# EAGLE design ticc (EAGLE 7.7.0)
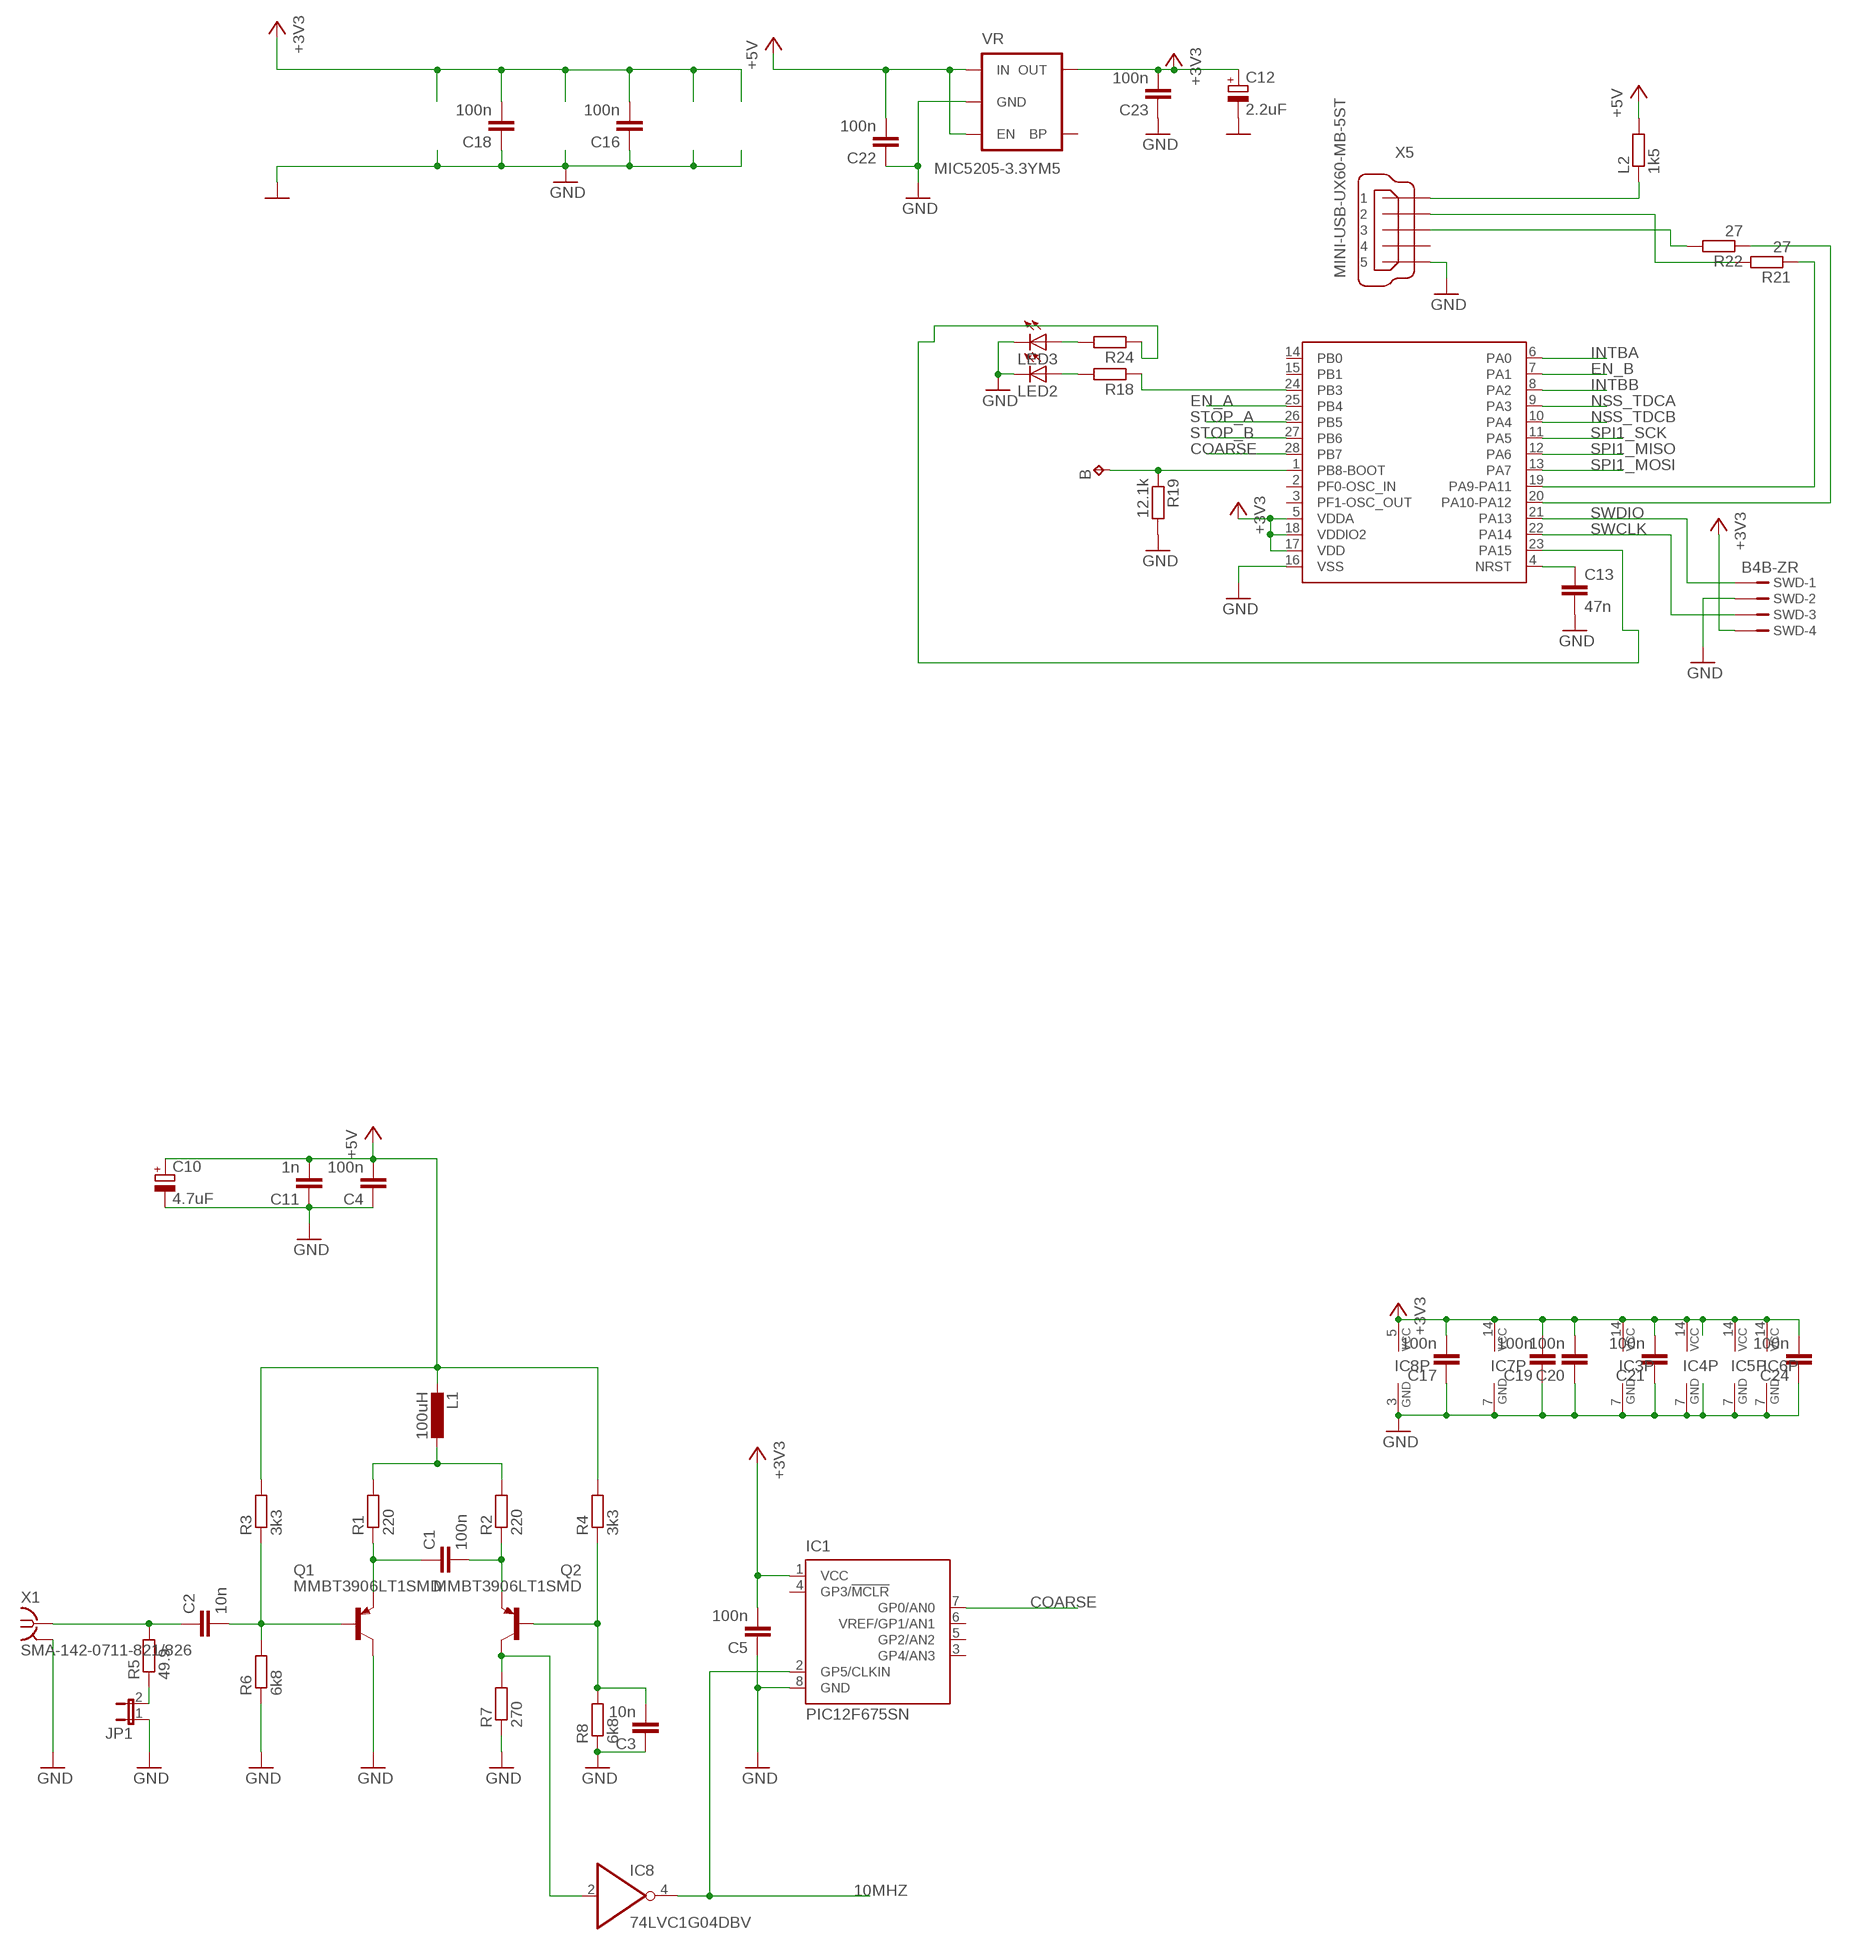
[diagram p0: schematic, sheet 1, part 1 of 2]
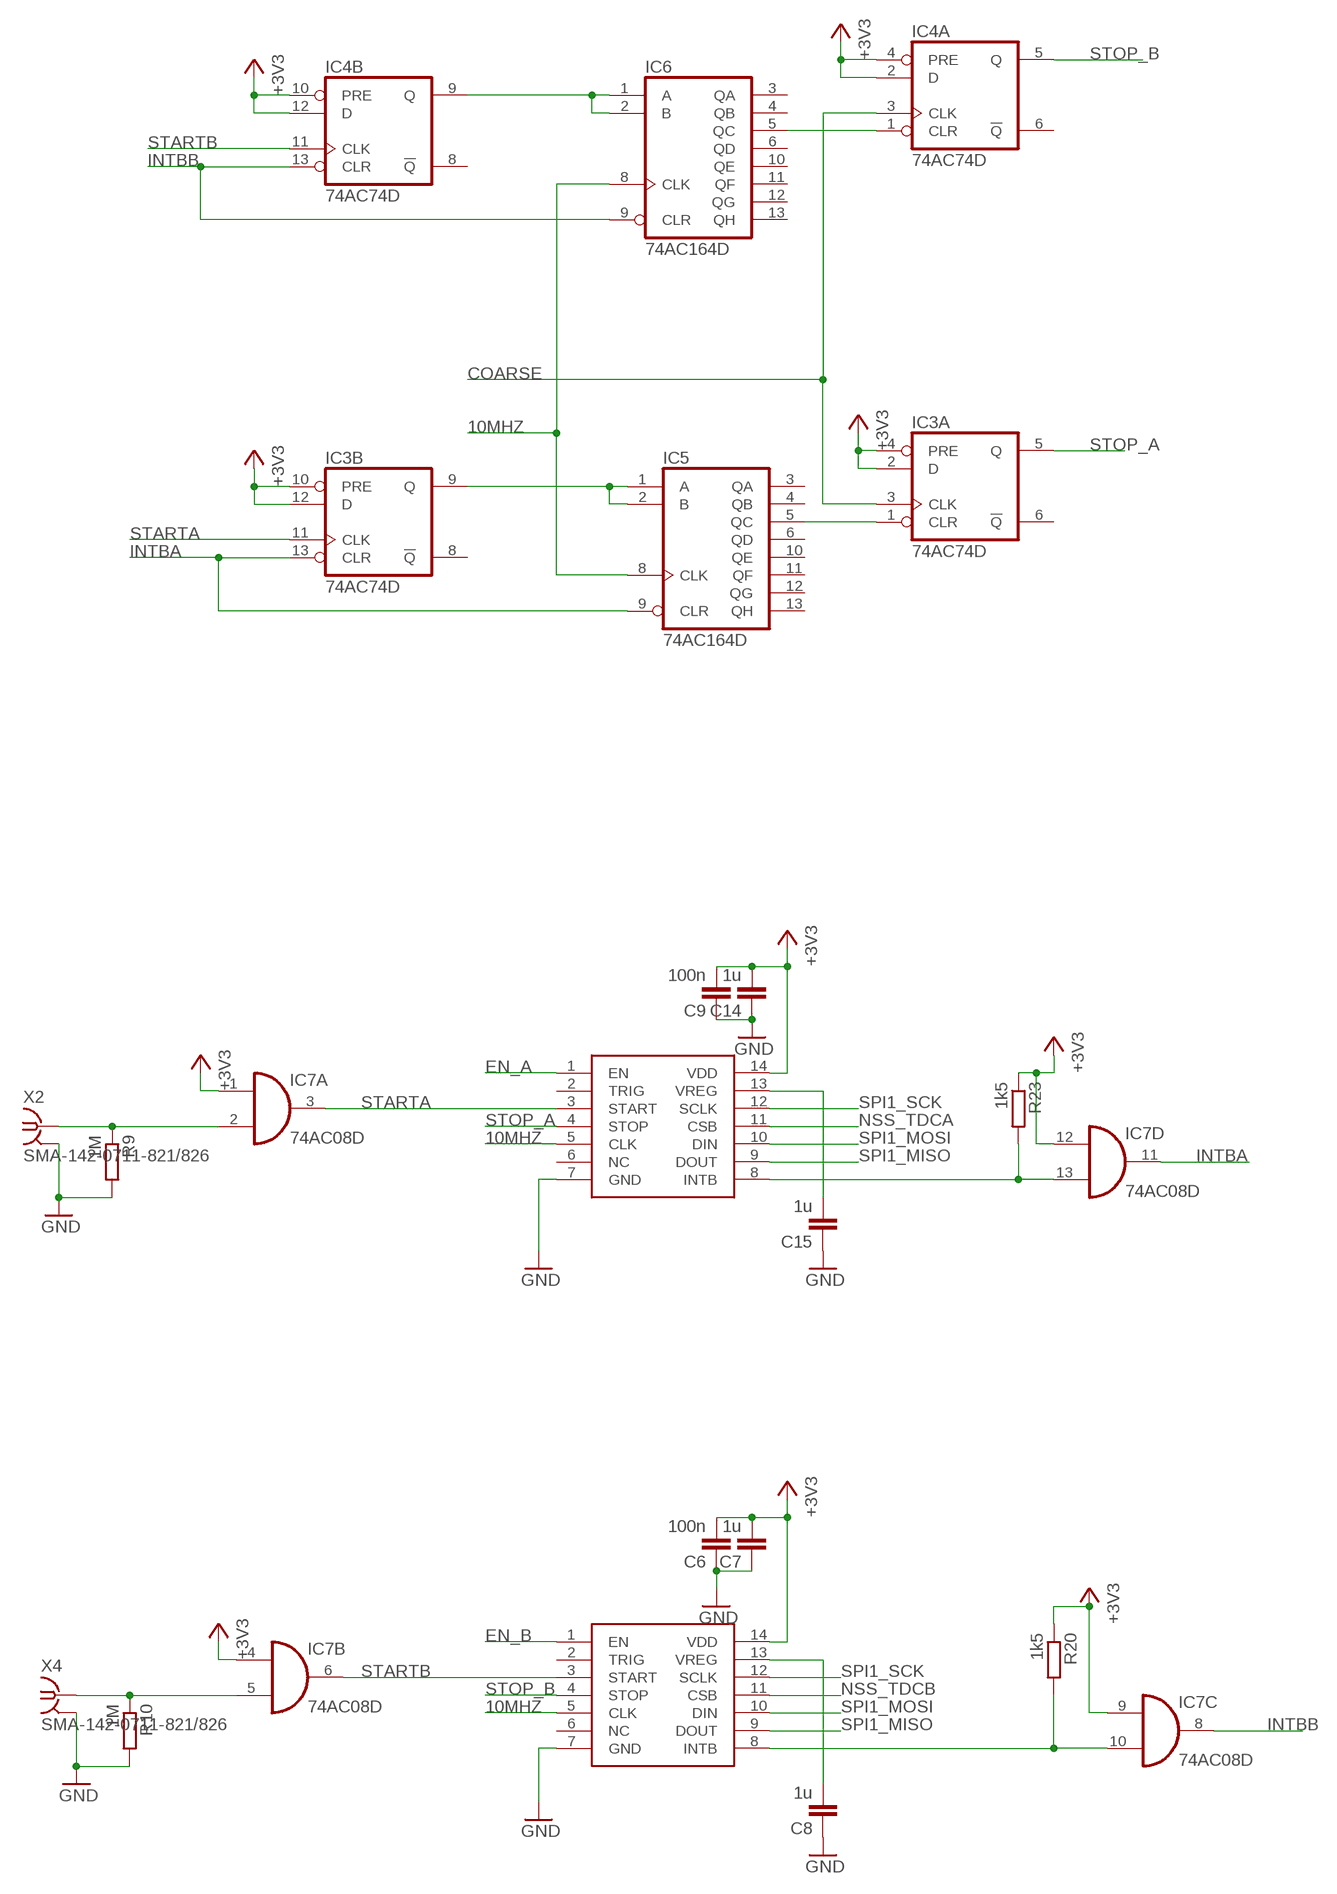
[diagram p1: schematic, sheet 1, part 2 of 2]

## Parts
B  TPB1,27  [B1,27]
C1  100n  C-EUC0603  [C0603]
C2  10n  C-EUC0603  [C0603]
C3  10n  C-EUC0603  [C0603]
C4  100n  C-EUC0603  [C0603]
C5  100n  C-EUC0603  [C0603]
C6  100n  C-EUC0603  [C0603]
C7  1u  C-EUC0603  [C0603]
C8  1u  C-EUC0603  [C0603]
C9  100n  C-EUC0603  [C0603]
C10  4.7uF  CPOL-EUSMCA  [SMC_A]
C11  1n  C-EUC0603  [C0603]
C12  2.2uF  CPOL-EUSMCA  [SMC_A]
C13  47n  C-EUC0603  [C0603]
C14  1u  C-EUC0603  [C0603]
C15  1u  C-EUC0603  [C0603]
C16  100n  C-EUC0603  [C0603]
C17  100n  C-EUC0603  [C0603]
C18  100n  C-EUC0603  [C0603]
C19  100n  C-EUC0603  [C0603]
C20  100n  C-EUC0603  [C0603]
C21  100n  C-EUC0603  [C0603]
C22  100n  C-EUC0805K  [C0805K]
C23  100n  C-EUC0805K  [C0805K]
C24  100n  C-EUC0603  [C0603]
IC1  PIC12F675SN  [SO-08]
IC3  74AC74D  [SO14]
IC4  74AC74D  [SO14]
IC5  74AC164D  [SO14]
IC6  74AC164D  [SO14]
IC7  74AC08D  [SO14]
IC8  74LVC1G04DBV  [SOT23-5]
JP1  JUMPER-2PTH  [1X02]
L1  100uH  L-EUL2012C  [L2012C]
L2  1k5  R-EU_R0805  [R0805]
LED2  LEDCHIP-LED0805  [CHIP-LED0805]
LED3  LEDCHIP-LED0805  [CHIP-LED0805]
Q1  MMBT3906LT1SMD  [SOT23-BEC]
Q2  MMBT3906LT1SMD  [SOT23-BEC]
R1  220  R-EU_R0603  [R0603]
R2  220  R-EU_R0603  [R0603]
R3  3k3  R-EU_R0603  [R0603]
R4  3k3  R-EU_R0603  [R0603]
R5  49.9  R-EU_R0603  [R0603]
R6  6k8  R-EU_R0603  [R0603]
R7  270  R-EU_R0603  [R0603]
R8  6k8  R-EU_R0603  [R0603]
R9  1M  R-EU_R0603  [R0603]
R10  1M  R-EU_R0603  [R0603]
R18  R-EU_R0603  [R0603]
R19  12.1k  R-EU_R0603  [R0603]
R20  1k5  R-EU_R0603  [R0603]
R21  27  R-EU_R0603  [R0603]
R22  27  R-EU_R0603  [R0603]
R23  1k5  R-EU_R0603  [R0603]
R24  R-EU_R0603  [R0603]
SWD  B4B-ZR  [B4B-ZR]
U$1  STM32F042G  [QFN28]
U$2  TDC7200  [TSSOP14]
U$3  TDC7200  [TSSOP14]
VR  MIC5205-3.3YM5  V_REG_LDOSMD  [SOT23-5]
X1  SMA-142-0711-821/826  [J502-ND-142-0711-821/826]
X2  SMA-142-0711-821/826  [J502-ND-142-0711-821/826]
X4  SMA-142-0711-821/826  [J502-ND-142-0711-821/826]
X5  MINI-USB-UX60-MB-5ST  [UX60-MB-5ST]

## Nets
10MHZ: IC1.2(GP5/CLKIN) IC5.8(CLK) IC6.8(CLK) IC8.4(O) U$2.5(CLK) U$3.5(CLK)
+3V3: C5.2 C6.2 C7.2 C9.2 C12.+ C14.2 C16.2 C17.2 C18.2 C19.2 C20.2 C21.2 C23.2 C24.2 IC1.1(VCC) IC3.2(A:D) IC3.4(A:PRE) IC3.10(B:PRE) IC3.12(B:D) IC3.14(P:VCC) IC4.2(A:D) IC4.4(A:PRE) IC4.10(B:PRE) IC4.12(B:D) IC4.14(P:VCC) IC5.14(VCC) IC6.14(VCC) IC7.1(A:I0) IC7.4(B:I0) IC7.9(C:I0) IC7.12(D:I0) IC7.14(P:VCC) IC8.5(VCC) R20.1 R23.1 SWD.4 U$1.5(VDDA) U$1.17(VDD) U$1.18(VDDIO2) U$2.14(VDD) U$3.14(VDD) VR.5(OUT)
+5V: C4.2 C10.+ C11.2 C22.2 L1.2 L2.2 R3.2 R4.2 VR.1(IN) VR.3(EN)
COARSE: IC1.7(GP0/AN0) IC3.3(A:CLK) IC4.3(A:CLK) U$1.28(PB7)
EN_A: U$1.25(PB4) U$2.1(EN)
EN_B: U$1.7(PA1) U$3.1(EN)
GND: C3.1 C4.1 C5.1 C6.1 C7.1 C8.1 C9.1 C10.- C11.1 C12.- C13.2 C14.1 C15.1 C16.1 C17.1 C18.1 C19.1 C20.1 C21.1 C22.1 C23.1 C24.1 IC1.8(GND) IC3.7(P:GND) IC4.7(P:GND) IC5.7(GND) IC6.7(GND) IC7.7(P:GND) IC8.3(GND) JP1.1 LED2.C LED3.C Q1.C R6.1 R7.1 R8.1 R9.2 R10.2 R19.2 SWD.2 U$1.16(VSS) U$2.7(GND) U$3.7(GND) VR.2(GND) X1.G@1(GND) X2.G@1(GND) X4.G@1(GND) X5.5
INTBA: IC3.13(B:CLR) IC5.9(CLR) IC7.11(D:O) U$1.6(PA0)
INTBB: IC4.13(B:CLR) IC6.9(CLR) IC7.8(C:O) U$1.8(PA2)
N$1: C3.2 Q2.B R4.1 R8.2
N$2: JP1.2 R5.1
N$3: C2.1 R5.2 X1.1
N$4: C2.2 Q1.B R3.1 R6.2
N$5: L1.1 R1.2 R2.2
N$6: C1.2 Q2.E R2.1
N$7: C1.1 Q1.E R1.1
N$8: R22.2 X5.3
N$9: IC8.2(I) Q2.C R7.2
N$10: IC7.2(A:I1) R9.1 X2.1
N$11: R21.2 X5.2
N$12: IC7.5(B:I1) R10.1 X4.1
N$13: R18.1 U$1.24(PB3)
N$14: C15.2 U$2.13(VREG)
N$20: L2.1 X5.1
N$21: R21.1 U$1.19(PA9-PA11)
N$22: IC3.1(A:CLR) IC5.5(QC)
N$25: R22.1 U$1.20(PA10-PA12)
N$26: B.PP(TP) R19.1 U$1.1(PB8-BOOT)
N$27: C13.1 U$1.4(NRST)
N$28: LED2.A R18.2
N$31: IC4.1(A:CLR) IC6.5(QC)
N$32: IC3.9(B:Q) IC5.1(A) IC5.2(B)
N$33: IC4.9(B:Q) IC6.1(A) IC6.2(B)
N$34: R24.1 U$1.23(PA15)
N$35: IC7.10(C:I1) R20.2 U$3.8(INTB)
N$36: IC7.13(D:I1) R23.2 U$2.8(INTB)
N$37: LED3.A R24.2
N$39: C8.2 U$3.13(VREG)
NSS_TDCA: U$1.9(PA3) U$2.11(CSB)
NSS_TDCB: U$1.10(PA4) U$3.11(CSB)
SPI1_MISO: U$1.12(PA6) U$2.9(DOUT) U$3.9(DOUT)
SPI1_MOSI: U$1.13(PA7) U$2.10(DIN) U$3.10(DIN)
SPI1_SCK: U$1.11(PA5) U$2.12(SCLK) U$3.12(SCLK)
STARTA: IC3.11(B:CLK) IC7.3(A:O) U$2.3(START)
STARTB: IC4.11(B:CLK) IC7.6(B:O) U$3.3(START)
STOP_A: IC3.5(A:Q) U$1.26(PB5) U$2.4(STOP)
STOP_B: IC4.5(A:Q) U$1.27(PB6) U$3.4(STOP)
SWCLK: SWD.3 U$1.22(PA14)
SWDIO: SWD.1 U$1.21(PA13)
Unconnected: IC1.3(GP4/AN3) IC1.4(GP3/!MCLR) IC1.5(GP2/AN2) IC1.6(VREF/GP1/AN1) IC3.6(A:!Q) IC3.8(B:!Q) IC4.6(A:!Q) IC4.8(B:!Q) IC5.3(QA) IC5.4(QB) IC5.6(QD) IC5.10(QE) IC5.11(QF) IC5.12(QG) IC5.13(QH) IC6.3(QA) IC6.4(QB) IC6.6(QD) IC6.10(QE) IC6.11(QF) IC6.12(QG) IC6.13(QH) U$1.2(PF0-OSC_IN) U$1.3(PF1-OSC_OUT) U$1.14(PB0) U$1.15(PB1) U$2.2(TRIG) U$2.6(NC) U$3.2(TRIG) U$3.6(NC) VR.4(BP) X5.4

## Power pins joined to a net without a drawn wire
GND: X1.G@2(GND) X1.G@3(GND) X1.G@4(GND) X2.G@2(GND) X2.G@3(GND) X2.G@4(GND) X4.G@2(GND) X4.G@3(GND) X4.G@4(GND)

## Library data of the parts
B = testpad:TP: Test pad
C1-C9 C11 C13-C24 = rcl:C-EU: CAPACITOR, European symbol
C10 C12 = rcl:CPOL-EU: POLARIZED CAPACITOR, European symbol
IC1 = microchip:PIC12F675: 8-Pin FLASH-Based 8-Bit CMOS Microcontroller Precision Internal 4 MHz oscillator factory calibrated to ±1% Low Power Features: Standby Current: - 1 nA @ 2.0V, typical Operating Current: - 8.5µA @ 32 kHz, 2.0V, typical - 100µA @ 1 MHz, 2.0V, typical Watchdog Timer Current: - 300 nA @ 2.0V, typical Timer1 oscillator current: - 4µA @ 32 kHz, 2.0V, typical Analog-to-Digital Converter module: - 10-bit resolution - Programmable 4-channel input - Voltage reference input Source: http://www.microchip.com .. 41190E.pdf; MF: MICROCHIP; MPN: PIC12F675-E/SN; OC_FARNELL: 9759026; OC_NEWARK: 92C4341
IC3 IC4 = 74xx-eu:74*74: Dual D type positive edge triggered FLIP FLOP, preset and clear
IC5 IC6 = 74xx-eu:74*164: 8-bit parallel out SHIFT REGISTER
IC7 = 74xx-eu:74*08: Quad 2-input AND gate
IC8 = 74xx-little-de:74*1G04: INVERTER Gate
JP1 = SparkFun:JUMPER-2: Jumper Basic 0.1" spaced jumper. Use with breakaway headers.
L1 = rcl:L-EU: INDUCTOR, European symbol
L2 R1-R10 R18-R24 = rcl:R-EU_: RESISTOR, European symbol
LED2 LED3 = led:LED: LED OSRAM: - CHIPLED LG R971, LG N971, LY N971, LG Q971, LY Q971, LO R971, LY R971 LH N974, LH R974 LS Q976, LO Q976, LY Q976 LO Q996 - Hyper CHIPLED LW Q18S LB Q993, LB Q99A, LB R99A - SideLED LS A670, LO A670, LY A670, LG A670, LP A670 LB A673, LV A673, LT A673, LW A673 LH A674 LY A675 LS A676, LA A676, LO A676, LY A676, LW A676 LS A679, LY A679, LG A679 - Hyper Micro SIDELED® LS Y876, LA Y876, LO Y876, LY Y876 LT Y87S - SmartLED LW L88C, LW L88S LB L89C, LB L89S, LG L890 LS L89K, LO L89K, LY L89K LS L896, LA L896, LO L896, LY L896 - TOPLED LS T670, LO T670, LY T670, LG T670, LP T670 LSG T670, LSP T670, LSY T670, LOP T670, LYG T670 LG T671, LOG T671, LSG T671 LB T673, LV T673, LT T673, LW T673 LH T674 LS T676, LA T676, LO T676, LY T676, LB T676, LH T676, LSB T676, LW T676 LB T67C, LV T67C, LT T67C, LS T67K, LO T67K, LY T67K, LW E67C LS E67B, LA E67B, LO E67B, LY E67B, LB E67C, LV E67C, LT E67C LW T67C LS T679, LY T679, LG T679 LS T770, LO T770, LY T770, LG T770, LP T770 LB T773, LV T773, LT T773, LW T773 LH T774 LS E675, LA E675, LY E675, LS T675 LS T776, LA T776, LO T776, LY T776, LB T776 LHGB T686 LT T68C, LB T68C - Hyper Mini TOPLED® LB M676 - Mini TOPLED Santana® LG M470 LS M47K, LO M47K, LY M47K Source: http://www.osram.convergy.de LUXEON: - LUMILED® LXK2-PW12-R00, LXK2-PW12-S00, LXK2-PW14-U00, LXK2-PW14-V00 LXK2-PM12-R00, LXK2-PM12-S00, LXK2-PM14-U00 LXK2-PE12-Q00, LXK2-PE12-R00, LXK2-PE12-S00, LXK2-PE14-T00, LXK2-PE14-U00 LXK2-PB12-K00, LXK2-PB12-L00, LXK2-PB12-M00, LXK2-PB14-N00, LXK2-PB14-P00, LXK2-PB14-Q00 LXK2-PR12-L00, LXK2-PR12-M00, LXK2-PR14-Q00, LXK2-PR14-R00 LXK2-PD12-Q00, LXK2-PD12-R00, LXK2-PD12-S00 LXK2-PH12-R00, LXK2-PH12-S00 LXK2-PL12-P00, LXK2-PL12-Q00, LXK2-PL12-R00 Source: www.luxeon.com KINGBRIGHT: KA-3528ASYC Source: www.kingbright.com
Q1 Q2 = transistor-pnp:MMBT3906*: PNP Transistror
SWD = con-jst:?4B-ZR: ZH CONNECTOR 1.5 mm, 4 pin 1 row Source: http://www.jst.com .. eZH.pdf; MF: FARNELL; MPN: B4B-ZR(LF)(SN); OC_FARNELL: 1830916; OC_NEWARK: 37K9960
U$1 = stm32f107:STM32F042G
U$2 U$3 = tdc7200:TDC7200
VR = SparkFun:V_REG_LDO: Voltage Regulator LDO Standard 150mA LDO voltage regulator in SOT-23 layout. Micrel part MIC5205. BP (by-pass) pin is used to lower output noise with 470pF cap.
X1 X2 X4 = con-coax:SMA-: SMA 50 Ohm End Launch Jack Receptacle - Round Contact Johnson Components Source: www.johnsoncomponents.com .. J502-ND.pdf; MF: JOHNSON COMPONENTS; MPN: 142-0711-821; OC_FARNELL: 1019328; OC_NEWARK: 16F3627
X5 = con-hirose:MINI-USB-: MINI USB Connector Source: http://www.hirose.co.jp/cataloge_hp/e24000019.pdf; OC_FARNELL: unknown; OC_NEWARK: unknown

## Board
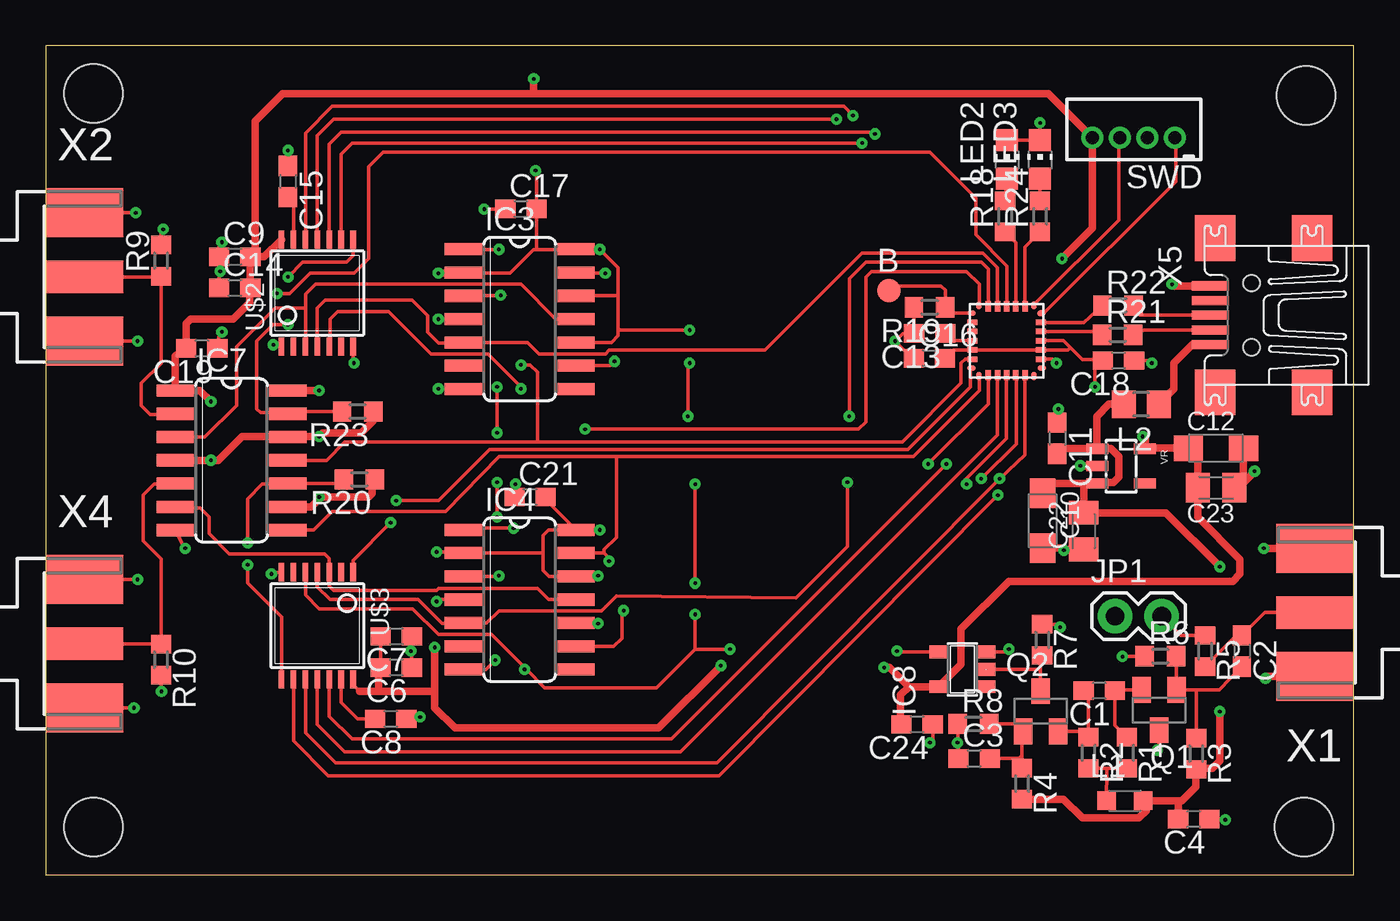
[diagram p2: board, top side]
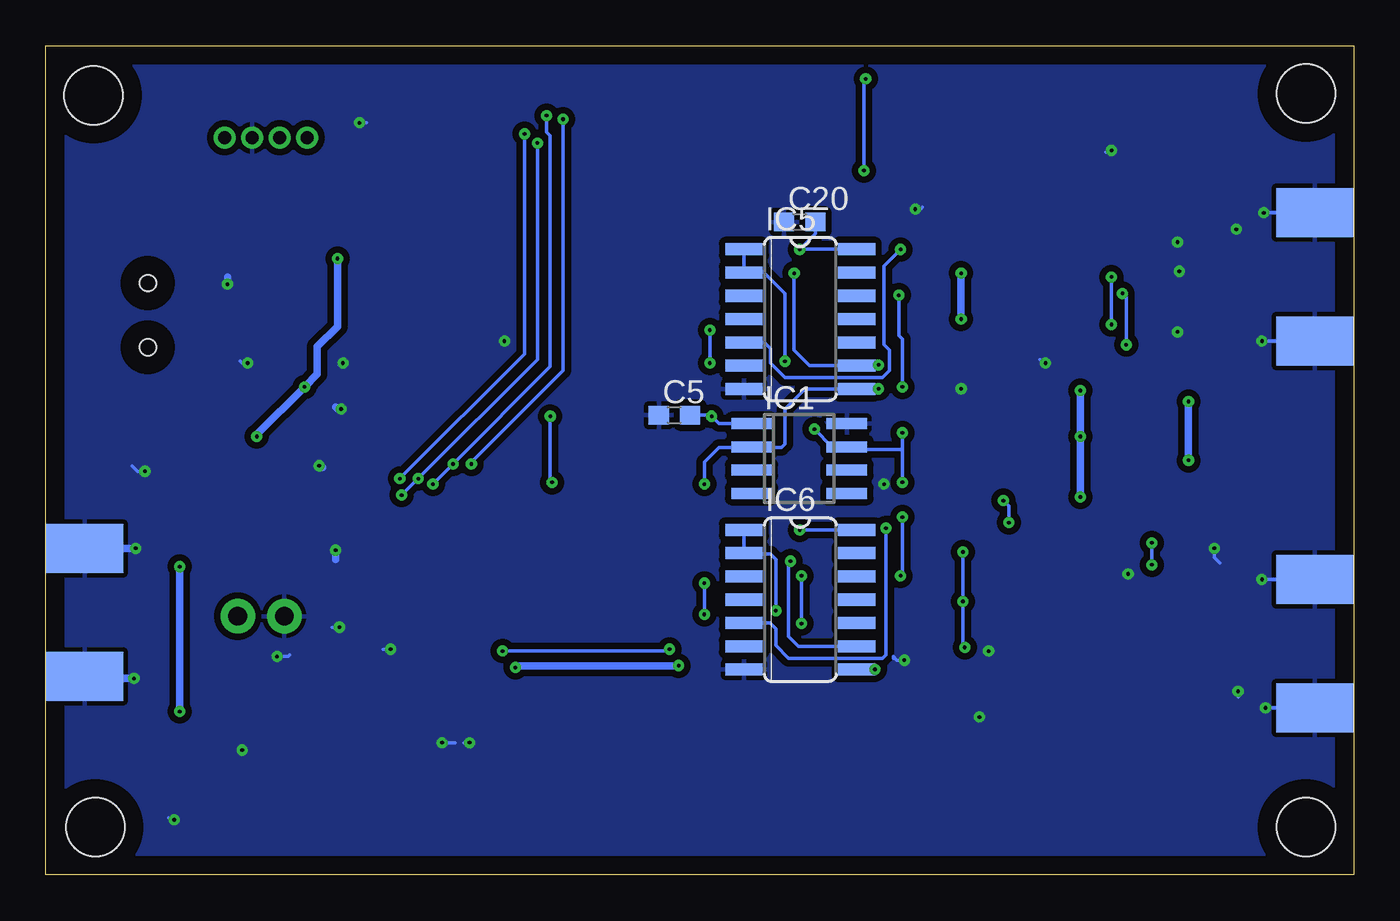
[diagram p3: board, bottom side, seen from below]

Size 71.3 x 45.2 mm. Coordinates in mm from the lower left corner, seen from the top.
Outline: 0,0 71.3,0 71.3,45.2 0,45.2 0,0
Copper layers (1*16): Top 0.035mm / dielectric 1.5mm / Bottom 0.035mm
Design rules "vyroba": minimum track width 0.15mm, minimum drill 0.3mm, track to track 0.35mm, track to pad 0.35mm, pad to pad 0.35mm, via to via 0.35mm, smd to smd 0mil, copper to edge 40mil, drill to drill 8mil, minimum pad ring 10mil, minimum via ring 8mil, stop-mask expansion 4mil, vias tented up to drill 0mil, thermal gap 10mil
Holes 3.2 mm at 2.6,42.6 68.7,42.5 68.6,2.6 2.6,2.6

### Footprints (pad centres in the part's own frame; a part is rotated, then mirrored left to right if it is on the bottom)
B1,27 = smd 1.27 x 1.27: PP 0,0
C0603 = smd 1.1 x 1: 1 -0.85,0; 2 0.85,0
SMC_A = smd 1.6 x 1.4: + -1.5,0; - 1.5,0
C0805K = smd 1.3 x 1.6: 1 -1,0; 2 1,0
SO-08 = smd 0.6 x 2.2: 1 -1.905,-2.6; 2 -0.635,-2.6; 3 0.635,-2.6; 4 1.905,-2.6; 5 1.905,2.6; 6 0.635,2.6; 7 -0.635,2.6; 8 -1.905,2.6
SO14 = smd 0.66 x 2.032: 1 -3.81,-3.073; 2 -2.54,-3.073; 3 -1.27,-3.073; 4 0,-3.073; 5 1.27,-3.073; 6 2.54,-3.073; 7 3.81,-3.073; 8 3.81,3.073; 9 2.54,3.073; 10 1.27,3.073; 11 0,3.073; 12 -1.27,3.073; 13 -2.54,3.073; 14 -3.81,3.073
SOT23-5 = smd 0.69 x 0.99: 1 -0.95,-1.29; 2 0,-1.29; 3 0.95,-1.29; 4 0.95,1.3; 5 -0.95,1.3
1X02 = drill 1.016 pad 1.88: 1 0,0; 2 2.54,0
L2012C = smd 1 x 1: 1 -1,0; 2 1,0
R0805 = smd 1.3 x 1.5: 1 -0.95,0; 2 0.95,0
CHIP-LED0805 = smd 1.2 x 1.2: A 0,-1.05; C 0,1.05
SOT23-BEC = smd 1 x 1.4: B -0.95,-1.1; C 0,1.1; E 0.95,-1.1
R0603 = smd 1 x 1.1: 1 -0.85,0; 2 0.85,0
B4B-ZR = drill 0.7 pad 1.1: 1 -2.25,0; 2 -0.75,0; 3 0.75,0; 4 2.25,0
QFN28 = smd 0.45 x 0.3: 1 -1.925,1.5; 7 -1.925,-1.5; 15 1.925,-1.5 | smd 0.55 x 0.3: 2 -1.875,1; 3 -1.875,0.5; 4 -1.875,0; 5 -1.875,-0.5; 6 -1.875,-1; 16 1.875,-1; 17 1.875,-0.5; 18 1.875,0; 19 1.875,0.5; 20 1.875,1 | smd 0.3 x 0.45: 8 -1.5,-1.925; 14 1.5,-1.925; 22 1.5,1.925; 28 -1.5,1.925 | smd 0.3 x 0.55: 9 -1,-1.875; 10 -0.5,-1.875; 11 0,-1.875; 12 0.5,-1.875; 13 1,-1.875; 23 1,1.875; 24 0.5,1.875; 25 0,1.875; 26 -0.5,1.875; 27 -1,1.875 | smd 0.45 x 0.325: 21 1.9,1.5
TSSOP14 = smd 0.305 x 0.991: 1 -1.95,-2.918; 2 -1.3,-2.918; 3 -0.65,-2.918; 4 0,-2.918; 5 0.65,-2.918; 6 1.3,-2.918; 7 1.95,-2.918; 8 1.95,2.918; 9 1.3,2.918; 10 0.65,2.918; 11 0,2.918; 12 -0.65,2.918; 13 -1.3,2.918; 14 -1.95,2.918
SOT23-5' = smd 0.55 x 1.2: 1 -0.95,-1.3; 2 0,-1.3; 3 0.95,-1.3; 4 0.95,1.3; 5 -0.95,1.3
J502-ND-142-0711-821/826 = smd 4.191 x 1.778: 1 2.115,0 | smd 4.191 x 2.667: G@1 2.115,3.495; G@2 2.115,-3.495 | smd 4.191 x 2.667 bottom: G@3 2.115,3.495; G@4 2.115,-3.495
UX60-MB-5ST = smd 2 x 0.5: 1 2.25,1.6; 2 2.25,0.8; 3 2.25,0; 4 2.25,-0.8; 5 2.25,-1.6 | smd 2.2 x 2.5: M1 -3.3,-4.2; M2 -3.3,4.2; M3 2,4.2; M4 2,-4.2 | hole 0.9: 0,-1.75; 0,1.75

### Placement (x,y rotation side)
B  45.97,31.85 0 top
C1  57.43,10.04 180 top
C2  65.2,12.2 270 top
C3  50.61,6.34 0 top
C4  62.58,3.04 180 top
C5  37.03,25.06 0 bottom
C6  19.1,11.3 180 top
C7  19.1,13 180 top
C8  18.8,8.5 180 top
C9  10.3,33.7 0 top
C10  54.34,19.31 270 top
C11  55.14,23.81 270 top
C12  63.79,23.26 0 top
C13  48.19,29.52 180 top
C14  10.3,32 0 top
C15  13.2,37.8 270 top
C16  48.17,28.16 0 top
C17  25.9,36.3 0 top
C18  58.48,28.04 180 top
C19  8.5,28.7 180 top
C20  30.2,35.6 0 bottom
C21  26.4,20.6 0 top
C22  56.58,18.74 90 top
C23  63.8,21.1 180 top
C24  47.5,8.2 180 top
IC1  30.23,22.7 270 bottom
IC3  25.83,30.3 270 top
IC4  25.83,15 270 top
IC5  30.17,30.3 270 bottom
IC6  30.17,15 270 bottom
IC7  10.12,22.6 270 top
IC8  49.97,11.2 90 top
JP1  58.3,14.1 0 top
L1  58.83,4.04 0 top
L2  59.72,25.66 180 top
LED2  52.4,39 0 top
LED3  54.2,39 0 top
Q1  60.69,8.98 180 top
Q2  54.23,8.92 0 top
R1  58.94,6.65 270 top
R2  56.84,6.65 270 top
R3  62.72,6.6 270 top
R4  53.22,4.97 270 top
R5  63.2,12.2 270 top
R6  60.76,11.92 0 top
R7  54.32,12.81 270 top
R8  50.57,8.22 0 top
R9  6.28,33.49 90 top
R10  6.28,11.73 270 top
R18  52.3,35.9 90 top
R19  48.18,30.94 180 top
R20  17.09,21.56 180 top
R21  58.43,29.44 0 top
R22  58.45,31.04 0 top
R23  17,25.26 180 top
R24  54.2,35.9 90 top
SWD  59.31,40.19 180 top
U$1  52.38,29.12 0 top
U$2  14.8,31.72 0 top
U$3  14.8,13.58 180 top
VR  MIC5205-3.3YM5  [SOT23-5']  58.62,22.28 270 top
X1  71.3,14.3 180 top
X2  0,32.6 0 top
X4  0,12.6 0 top
X5  65.74,30.51 180 top

### Tracks (layer width: path | path; a pad name or v marks a point on that pad's centre or on a via)
10MHZ  (via drill 0.2)
  Top 0.2: U$3.5 14.15,15.25 14.9,14.5 20,14.5 21.4,13.1 24.3,13.1 26.1,11.3 v26.1,11.2 26.2,11.2 27.2,10.2 33.3,10.2 35.4,12.3 | v25.9,26.5 25.9,26.6 24.1,28.4 21,28.4 18.7,30.7 15.9,30.7 15.5,30.3 15.5,28.85 U$2.5 | v35.4,21.3 v35.4,15.9 | 35.4,12.3 v35.4,14.2 35.6,14.1 | IC8.4 46.45,12.15 v46.4,12.2 | v37.3,12.3 35.4,12.3
  Bottom 0.2: v25.9,26.5 25.81,26.49 IC5.8 29.91,26.49 31,25.4 31,23.5 31.2,23.3 32.8,23.3 | 32.8,23.3 IC1.2 | 27.09,11.2 27.3,11.2 | 27.09,11.2 IC6.8 | 32.8,23.3 34.6,23.3 35.4,22.5 v35.4,21.3 | v35.4,15.9 v35.4,14.2 | v46.4,12.2 37.4,12.2 v37.3,12.3 | 27.09,11.2 v26.1,11.2
+3V3  (via drill 0.2)
  Top 0.2: C21.2 27.25,20.46 IC4.14 | IC4.14 v30.19,18.81 v30.2,18.8 | 27.1,17.6 27.1,16.6 27.43,16.27 IC4.12 28.93,16.3 v30.1,16.3 | 27.1,17.6 27.1,18.5 27.4,18.8 IC4.14 | IC3.4 v21.4,30.3 | IC3.2 22.8,32.8 25.3,32.8 26.6,34.1 26.7,34.1 | 18.25,13.07 C7.2 C6.2 18.15,11.2 | 14.9,20.5 v14.9,20.6 | 13.22,23.9 IC7.12 | 17.8,21.42 R20.1 | R23.1 17.85,24.75 | 15.1,24.1 v14.9,23.9 | v14.89,26.41 v14.9,26.4 | 26.7,34.1 IC3.14 28.91,34.1 v30.2,34.1 31.2,33.1 31.2,31.5 | 26.7,34.1 26.75,34.15 C17.2 26.75,38.35 v26.7,38.4 | IC4.4 21.4,15 v21.3,14.9 | v21.3,17.6 22.7,17.6 IC4.2 27.04,17.54 27.1,17.6 | IC3.10 30.83,29.03 31.2,29.4 31.2,29.8 | 31.2,29.8 31.2,31.5 | IC3.12 31.13,31.57 31.2,31.5 | IC4.10 30.07,13.73 v30.1,13.7 | 11.1,31.95 C14.2 | 11.4,33.95 C9.2 | U$3.14 16.75,10.35 17.1,10 | 18.15,10.05 18.1,10 | v35,25 35,27.8 v35.1,27.9 | v35.1,29.7 31.3,29.7 31.2,29.8 | U$1.18 55.48,29.12 55.85,28.75 | 55.85,28.75 56.5,28.1 57.4,28.1 | 57.4,28.1 57.57,28.1 C18.2 | 55.85,28.75 55.72,28.62 U$1.17 U$1.5 49.48,28.62 C16.2 | 46.6,8.25 C24.2 | 59.95,23.26 VR.5 | 62.8,22.75 C12.+ | 59.95,23.75 v59.8,23.9 | v57.2,26.6 57.2,27.9 57.4,28.1
  Top 0.406: C14.2 C9.2 11.91,33.7 U$2.14 | v21.4,32.8 22.8,32.8 | IC7.9 14.46,20.06 14.9,20.5 | v14.9,23.9 13.22,23.9 | v14.9,20.6 17.6,20.6 17.8,20.8 17.8,21.42 | 17.85,24.75 17.2,24.1 15.1,24.1 | IC7.14 v14.89,26.41 | 11.1,31.95 11.1,31.2 10.2,30.3 7.9,30.3 7.65,30.05 C19.2 7.05,28.3 IC7.1 8.39,26.41 v9,25.8 | 17.1,10 18.1,10 21.2,10 | 18.15,11.2 18.15,10.05 | 47.05,10.25 IC8.5 49.9,11.48 49.9,13.4 52.5,16 64.7,16 65.1,16.4 65.1,17.2 62.8,19.5 C23.2 62.8,22.75 | 47.05,10.25 46.6,9.8 46.6,8.25 | 11.4,33.95 11.4,41.1 12.9,42.6 26.5,42.6 | 26.5,42.6 54.65,42.6 SWD.4 57.06,35.26 v55.4,33.6 | v26.6,43.4 26.6,42.7 26.5,42.6 | C12.+ 59.95,23.26 59.95,23.75 | v21.2,12.4 21.2,10 | 21.2,10 21.2,9.1 22.3,8 33.4,8 v36.8,11.4 | v45.7,11.3 46,11.3 47.05,10.25 | IC7.12 13.16,23.9 10.7,23.9 9.4,22.6 v9,22.6 7.4,22.6 7.3,22.5 7.15,22.5 IC7.4
  Bottom 0.2: v30.2,18.8 IC6.14 26.44,18.81 | IC5.14 v30.19,34.11 v30.2,34.1 29.35,34.95 C20.2 | v21.3,17.6 v21.3,14.9 21.3,12.5 v21.2,12.4 | v30.1,13.7 v30.1,16.3 | v26.7,38.4 26.7,43.3 v26.6,43.4 | IC1.1 34.6,24.61 v35,25 35.06,25.06 C5.2 | v35.1,27.9 v35.1,29.7 | v59.8,23.9 59.8,24
  Bottom 0.406: v21.4,30.3 v21.4,32.8 | v14.9,20.6 v14.9,23.9 v14.9,26.4 | 59.8,24 v57.2,26.6 56.5,27.3 56.5,28.8 55.4,29.9 v55.4,33.6 | v36.8,11.4 45.6,11.4 v45.7,11.3 | v9,25.8 v9,22.6
+5V  (via drill 0.2)
  Top 0.2: 62.7,5.73 R3.2 | 60,3.87 L1.2 | 61.73,3.91 61.6,4.04 | 57.3,23.25 VR.1 | 55.41,23.23 C11.2 | 57.39,21.4 VR.3 | 56.58,21.31 56.6,21.33
  Top 0.406: L1.2 61.6,4.04 61.94,4.04 62.7,4.8 62.7,5.73 | R4.2 55.48,4.12 56.5,3.1 59.6,3.1 60,3.5 60,3.87 | C4.2 61.73,3.91 | L2.2 57.96,25.66 57.3,25 57.3,23.25 | 55.41,23.23 VR.1 58.07,23.23 58.5,22.8 58.5,21.7 58.2,21.4 57.39,21.4 | VR.3 56.6,21.33 54.86,21.33 C10.+ | 56.58,21.31 C22.2 61.06,19.74 v64,16.8 | v64,8.9 64,6.2 63.6,5.8 62.77,5.8 R3.2
  Bottom 0.406: v64,16.8 v64,8.9
COARSE  (via drill 0.2)
  Top 0.2: IC3.3 25.03,31.57 v24.8,31.6 | IC4.3 24.67,16.27 v24.7,16.3 | v24.6,26.6 v24.6,24.1 | v24.6,21.4 v24.6,19.5 | v29.4,24.3 44.3,24.3 44.7,24.7 44.7,32.6 45,32.9 50.2,32.9 50.9,32.2 50.9,31.07 U$1.28
  Bottom 0.2: v24.8,31.6 24.8,29.4 24.6,29.2 v24.6,26.6 | 27.8,23.3 IC1.7 | IC1.7 28.43,23.34 v29.4,24.3 | v24.6,24.1 24.6,23.2 | 24.6,23.2 27.5,23.2 IC1.7 | 24.6,23.2 v24.6,21.4 | v24.6,19.5 24.6,16.4 v24.7,16.3
EN_A  (via drill 0.2)
  Top 0.2: U$2.1 12.5,28.8 v12.4,28.9 | v12.6,31.7 13.3,31.7 14.4,32.8 16.8,32.8 17.6,33.6 17.6,38.6 18.4,39.4 48.2,39.4 50.7,36.9 50.7,34.9 52.4,33.2 52.4,31.02 U$1.25
  Bottom 0.2: v12.4,28.9 12.4,31.5 v12.6,31.7
EN_B  (via drill 0.2)
  Top 0.2: U$3.1 16.75,17.15 v18.8,19.2 | v19.1,20.4 21.4,20.4 24.2,23.2 47,23.2 50.4,26.6 50.4,27.57 U$1.7
  Bottom 0.2: v18.8,19.2 18.8,20.1 v19.1,20.4
GND  (via drill 0.2)
  Top 0.2: IC7.7 7.55,17.85 v7.6,17.8 | C7.1 19.95,12.25 v19.9,12.2 19.95,12.15 C6.1 | C14.1 9.45,32.85 v9.5,32.9 9.45,32.95 C9.1 9.45,34.35 v9.6,34.5 | IC3.7 21.89,26.49 v21.4,26.5 | IC4.7 23.99,11.19 v24.5,11.7 | R10.2 6.28,10.02 v6.3,10 | v4.8,9.1 X4.G@4 | X4.G@1 v5,16.09 v5,16.1 | v5,29.1 X2.G@4 | X2.G@1 v4.89,36.09 v4.9,36.1 | R9.2 6.28,35.08 v6.4,35.2 | C19.1 9.45,29.45 v9.6,29.6 | U$2.7 16.75,27.95 v16.8,27.9 | C21.1 25.55,21.25 v25.6,21.3 | U$3.7 12.4,16.5 v12.3,16.4 | C15.1 v13.2,39.5 | C17.1 v23.9,36.3 | C8.1 20.3,8.5 v20.4,8.6 | LED2.C LED3.C v54.2,41 | C18.1 60.16,28.04 v60.3,27.9 | U$1.16 54.88,28.12 v55.1,27.9 | Q1.C 60.69,6.89 v60.6,6.8 | R7.1 55.14,13.66 v55.3,13.5 | C3.1 49.76,7.14 v49.7,7.2 49.72,7.22 R8.1 | C24.1 48.35,7.35 v48.2,7.2 | IC8.3 52.35,12.15 v52.5,12.3 | C16.1 47.24,28.16 v46.3,29.1 46.72,29.52 C13.2 R19.2 | R6.1 58.72,11.92 v58.7,11.9 | C4.1 64.26,3.04 v64.3,3 | C23.1 65,21.1
  Top 0.406: 65,21.1 v65.9,22 | C12.- 65.29,21.59 C23.1 | X5.5 61.49,32.11 v61.4,32.2 | C22.1 55.54,17.74 v55.5,17.7 55.39,17.81 C10.- | VR.2 56.42,22.28 v56.4,22.3 | C11.1 55.14,25.34 v55.2,25.4 | v66.4,17.8 X1.G@4 | X1.G@1 66.61,10.8 v66.5,10.7
  Bottom 0.2: v7.6,17.8 7.6,17.3 7.3,17 | v19.9,12.2 20,12.1 | v9.5,32.9 9.5,33 | v9.6,34.5 9.5,34.6 | v24.5,11.7 24.9,11.7 25.1,11.9 25.1,11.8 | v6.3,10 6.3,9.7 | X4.G@4 v4.79,9.11 v4.8,9.1 | v5,16.1 X4.G@1 | X2.G@4 v5,29.11 v5,29.1 | v4.9,36.1 2,36.1 1.8,36.3 1.91,36.3 X2.G@1 | v6.4,35.2 6.6,35.2 | v9.6,29.6 9.6,29.7 9.7,29.8 | v16.8,27.9 16.9,27.9 17.1,28.1 | v25.6,21.3 25.8,21.3 | v12.3,16.4 12.3,16.3 12.4,16.2 | v13.2,39.5 13.4,39.5 13.5,39.4 | v23.9,36.3 23.6,36.3 23.5,36.4 | v20.4,8.6 20.5,8.6 20.6,8.5 | v54.2,41 53.8,41 | v60.3,27.9 60.6,27.9 60.7,28 | v55.1,27.9 55.2,27.9 55.3,27.8 | v60.6,6.8 60.8,6.8 | v55.3,13.5 55.7,13.5 | v49.7,7.2 49,7.2 | v48.2,7.2 48.5,7.2 | v52.5,12.3 52.9,12.3 | v46.3,29.1 46.3,29.3 | v58.7,11.9 58.1,11.9 58,12 | v64.3,3 64.5,3 64.6,3.1 | v65.9,22 66.3,22 66.6,22.3
  Bottom 0.406: v61.4,32.2 61.4,32.6 | v55.5,17.7 55.5,17.2 | v56.4,22.3 56.3,22.3 56.2,22.2 | v55.2,25.4 55.4,25.4 55.5,25.5 | X1.G@4 v66.41,17.8 v66.4,17.8 | v66.5,10.7 69.08,10.7 X1.G@1
  pour Bottom: 0.3,45.1 70.9,45.1 70.8,0.1 0.3,0.1 0.4,41.8
INTBA  (via drill 0.2)
  Top 0.2: v30.5,32.8 28.94,32.8 IC3.13 | IC7.11 15.3,22.6 16.3,23.6 26.9,23.6 | v25.9,27.8 26.4,27.8 26.8,27.4 26.8,23.7 26.9,23.6 | 26.9,23.6 46.7,23.6 49.9,26.8 49.9,27.9 50.12,28.12 U$1.6
  Bottom 0.2: v30.5,32.8 30.5,28.6 29.66,27.76 IC5.9 25.94,27.76 v25.9,27.8
INTBB  (via drill 0.2)
  Top 0.2: IC4.13 30.44,17.54 | 13.7,18.8 IC7.8 13.2,18.8 14.6,18.8 15.6,19.8 21.8,19.8 24.7,22.8 31.1,22.8 | v30.7,17.1 30.7,17.28 30.44,17.54 | 30.44,17.54 30.44,17.74 31.1,18.4 31.1,22.8 | 31.1,22.8 47.3,22.8 50.9,26.4 50.9,27.18 U$1.8
  Bottom 0.2: IC6.9 30.26,12.46 30.8,13 30.8,17 v30.7,17.1
N$1
  Top 0.2: R4.1 53.22,6.5 | 53.22,6.5 53.22,7.72 53.5,8 53.46,8 Q2.B 52.88,8.22 R8.2 | C3.2 53.06,6.34 53.22,6.5
N$2
  Top 0.2: R5.1 61.89,13.05 JP1.2
N$3
  Top 0.2: X1.1 66.45,14.3 C2.1 64.9,13.05 R5.2
N$4
  Top 0.2: 62.8,10.08 Q1.B 61.64,11.89 R6.2 | 62.8,10.08 63.97,10.08 C2.2 | R3.1 62.72,10 62.8,10.08
N$5
  Top 0.2: R2.2 57.9,5.8 | 57.9,5.8 R1.2 | L1.1 57.84,5.74 57.9,5.8
N$6
  Top 0.2: R2.1 56.84,7.9 | 56.84,7.9 56.84,9.78 C1.2 | Q2.E 56.76,7.82 56.84,7.9
N$7
  Top 0.2: Q1.E 58.32,10.08 C1.1 58.28,8.16 R1.1
N$8
  Top 0.2: X5.3 59.63,30.51 R22.2
N$9
  Top 0.2: Q2.C 54.23,11.2 | 54.23,11.2 54.23,11.87 R7.2 | IC8.2 54.23,11.2
N$10
  Top 0.2: X2.1 6.28,32.6 R9.1 6.28,27.88 5.2,26.8 5.2,25.6 5.7,25.1 7.51,25.1 IC7.2
N$11
  Top 0.2: X5.2 59.85,29.71 R21.2
N$12
  Top 0.2: X4.1 6.28,12.6 | 6.28,12.6 R10.1 | 6.28,12.6 6.28,17.22 5.3,18.2 5.3,20.7 5.9,21.3 7.52,21.3 IC7.5
N$13
  Top 0.2: U$1.24 52.88,34.47 R18.1
N$14
  Top 0.2: U$2.13 13.5,36.65 C15.2
N$20
  Top 0.406: X5.1 62.51,28.91 61.5,27.9 61.5,26.49 L2.1
N$21
  Top 0.2: U$1.19 57.1,29.62 R21.1
N$22  (via drill 0.2)
  Top 0.2: v24.7,34.1 IC3.1
  Bottom 0.2: IC5.5 32.13,29.03 31.8,28.7 31.8,27.9 31,27.1 25.7,27.1 25.3,27.5 25.3,28.6 25.6,28.9 25.6,33.2 v24.7,34.1
N$25
  Top 0.2: U$1.20 56.58,30.12 R22.1
N$26
  Top 0.2: U$1.1 49.35,30.62 R19.1 49.03,31.87 48.8,32.1 45.72,32.1 B.PP
N$27
  Top 0.2: U$1.4 49.44,29.12 C13.1
N$28
  Top 0.2: LED2.A R18.2
N$31  (via drill 0.2)
  Top 0.2: v25.5,18.9 22.85,18.9 IC4.1
  Bottom 0.2: IC6.5 31.83,13.73 31.5,13.4 31.5,12.5 30.8,11.8 25.7,11.8 25.5,12 v25.5,18.9
N$32  (via drill 0.2)
  Top 0.2: IC3.9 30.76,27.76 v31,28
  Bottom 0.2: IC5.1 IC5.2 33.18,32.9 32.2,32.9 31,31.7 v31,28
N$33  (via drill 0.2)
  Top 0.2: IC4.9 30.96,12.46 31.4,12.9 31.4,14.3 v31.5,14.4
  Bottom 0.2: IC6.1 IC6.2 33.2,17.5 31.8,17.5 31.5,17.2 v31.5,14.4
N$34
  Top 0.2: U$1.23 53.38,34.23 R24.1
N$35  (via drill 0.2)
  Top 0.2: R20.2 16.01,21.33 IC7.10 13.16,21.3 11.8,21.3 11,20.5 v11,18.1 | U$3.8 12.85,14.05 11,15.9 v11,16.9
  Bottom 0.2: v11,16.9 v11,18.1
N$36  (via drill 0.2)
  Top 0.2: U$2.8 16.75,33.75 16.4,33.4 14,33.4 v13.2,32.6 | v13.2,30 12.4,30 11.5,29.1 11.5,25.4 11.7,25.2 13.13,25.2 IC7.13 13.31,25.26 R23.2
  Bottom 0.2: v13.2,32.6 v13.2,30
N$37
  Top 0.2: R24.2 54.2,37.5 54.3,37.6 54.3,37.85 LED3.A
N$39
  Top 0.2: U$3.13 16.1,9.4 17,8.5 C8.2
NSS_TDCA  (via drill 0.2)
  Top 0.2: U$2.11 14.8,40.3 15.7,41.2 v43.1,41.2 | U$1.9 51.38,25.68 v48.1,22.4
  Bottom 0.2: v43.1,41.2 43.1,27.5 48.1,22.5 v48.1,22.4
NSS_TDCB
  Top 0.2: U$1.10 51.88,23.98 34.6,6.7 16.3,6.7 14.8,8.2 U$3.11
SPI1_MISO  (via drill 0.2)
  Top 0.2: U$2.9 16.1,39.3 16.7,39.9 v44.5,39.9 | v51.9,20.7 36.7,5.4 15.4,5.4 13.5,7.3 U$3.9 | v51,21.6 52.9,23.5 52.9,27.23 U$1.12
  Bottom 0.2: v44.5,39.9 44.5,28.1 v51,21.6 v51.9,20.7
SPI1_MOSI  (via drill 0.2)
  Top 0.2: U$2.10 15.45,39.85 16.1,40.5 45.1,40.5 v45.2,40.4 | U$3.10 14.15,7.75 15.8,6.1 36.6,6.1 v52,21.6 53.38,22.88 U$1.13
  Bottom 0.2: v45.2,40.4 45.2,28.4 v52,21.6
SPI1_SCK  (via drill 0.2)
  Top 0.2: U$2.12 14.15,40.45 15.6,41.9 43.5,41.9 v44,41.4 | U$1.11 52.38,23.78 50.2,21.6 v50.2,21.3 | v49.1,22.4 34.1,7.4 16.7,7.4 15.45,8.65 U$3.12
  Bottom 0.2: v50.2,21.3 v49.1,22.4 43.8,27.7 43.8,40.3 44,40.5 v44,41.4
STARTA
  Top 0.2: IC7.3 8.67,23.87 10.4,25.6 10.4,28.8 12.5,30.9 14.15,30.9 | 14.2,28.85 U$2.3 14.15,30.9 | IC3.11 27.8,30.3 25.9,32.2 14.7,32.2 14.15,31.65 14.15,30.9
STARTB
  Top 0.2: IC7.6 7.11,20 8.4,20 8.9,19.5 8.9,18.6 10,17.5 15.2,17.5 15.45,17.25 U$3.3 15.45,15.75 15.7,15.5 21.3,15.5 21.4,15.6 26.8,15.6 27.4,15 IC4.11
STOP_A
  Top 0.2: U$2.4 14.8,30.9 15.23,31.33 19.97,31.33 20.8,30.5 20.8,29.6 21.4,29 22.73,29 IC3.5 26.27,29.03 26.9,28.4 30.5,28.4 30.7,28.6 39.2,28.6 44.5,33.9 51.1,33.9 51.88,33.12 U$1.26
STOP_B  (via drill 0.2)
  Top 0.2: U$3.4 14.8,15.7 15.5,15 20.3,15 21.6,13.7 22.73,13.7 IC4.5 24.03,13.73 24.7,14.4 30.3,14.4 31.1,15.2 40.9,15.1 43.7,17.9 v43.7,21.4 | U$1.27 51.38,33.02 51,33.4 44.7,33.4 43.8,32.5 v43.8,25
  Bottom 0.2: v43.8,25 43.8,21.6 v43.7,21.4
SWCLK
  Top 0.2: U$1.22 53.88,31.08 58.5,35.7 58.5,40.13 SWD.3
SWDIO
  Top 0.2: U$1.21 54.42,30.62 61.6,37.8 61.6,40.15 SWD.1